# Altium schematic sheet investigator_regulator.SchDoc
size Letter
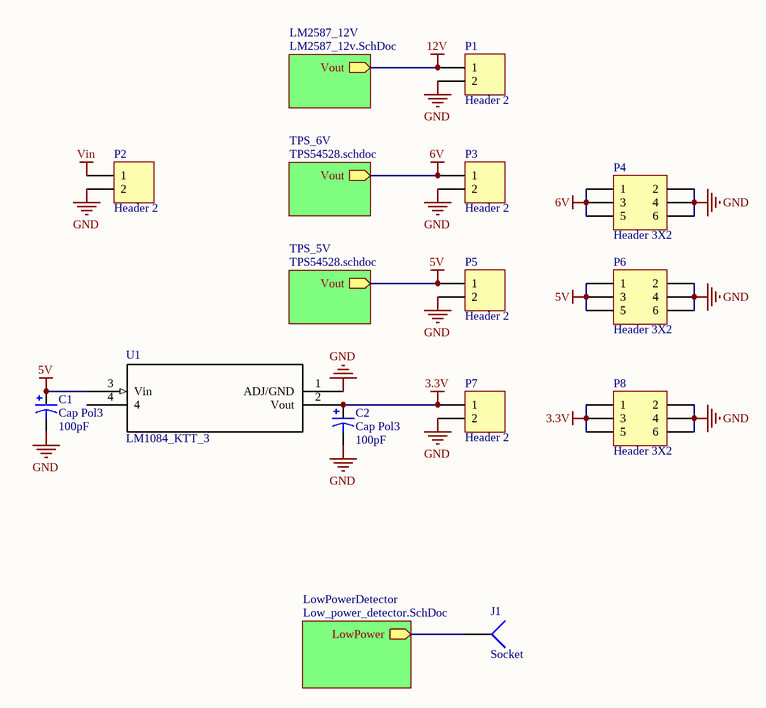
[diagram p0: investigator_regulator.SchDoc]

## Parts
C1  Cap Pol3  value 100pF  [AXIAL-0.3]
C2  Cap Pol3  value 100pF  [AXIAL-0.3]
J1  Socket  [PIN1]
P1  Header 2  [WireHeader]
P2  Header 2  [WireHeader]
P3  Header 2  [WireHeader]
P4  Header 3X2  [HDR2X3]
P5  Header 2  [WireHeader]
P6  Header 3X2  [HDR2X3]
P7  Header 2  [WireHeader]
P8  Header 3X2  [HDR2X3]
U1  LM1084_KTT_3  [TS3B]

## Sub-sheets
LM2587_12V = LM2587_12v.SchDoc: Vout (out)
LowPowerDetector = Low_power_detector.SchDoc: LowPower (out)
TPS_5V = TPS54528.schdoc: Vout (out)  | Rftb_value: 121K
TPS_6V = TPS54528.schdoc: Vout (out)  | Rftb_value: 150K

## Nets
3.3V: C2.1 P7.1 P8.1 P8.3 P8.5 U1.2(Vout)
5V: C1.1 P5.1 P6.1 P6.3 P6.5 U1.3(Vin) ; sheet TPS_5V/Vout
6V: P3.1 P4.1 P4.3 P4.5 ; sheet TPS_6V/Vout
12V: P1.1 ; sheet LM2587_12V/Vout
GND: C1.2 C2.2 P1.2 P2.2 P3.2 P4.2 P4.4 P4.6 P5.2 P6.2 P6.4 P6.6 P7.2 P8.2 P8.4 P8.6 U1.1(ADJ/GND)
Vin: P2.1
NetJ1_1: J1.1 ; sheet LowPowerDetector/LowPower

Not connected (* = marked no-connect by the designer): U1 4

## Library data of the parts
C1 C2 = Cap Pol3: Polarized Capacitor (Surface Mount); Published: 8-Jun-2000; LatestRevisionDate: 29-May-2009; LatestRevisionNote: IPC-7351 Footprint Added.; PackageReference: C0805; Publisher: Altium Limited; PackageDescription: Chip Capacitor
P1-P3 P5 P7 = Header 2: Header, 2-Pin; LatestRevisionDate: 17-Jul-2002; LatestRevisionNote: Re-released for DXP Platform.; Publisher: Altium Limited
P4 P6 P8 = Header 3X2: Header, 3-Pin, Dual row; LatestRevisionDate: 17-Jul-2002; LatestRevisionNote: Re-released for DXP Platform.; Publisher: Altium Limited
U1 = LM1084_KTT_3: Imported; PartNumber: LM1084IS-33; Comp: TypeLDO; Vendor: NationalSemiconductor; base_pn: LM1084; Symbol: NameLM1084IS-33; Library: ReferenceLM1084IS; Type: DEV; Version: 1; Pin: Count3; RefDes: RefDes; Value: Value
J1 = Socket: LatestRevisionDate: 17-Jul-2002; LatestRevisionNote: Re-released for DXP Platform.; Publisher: Altium Limited